# Altium schematic sheet HalfBridge_MOSFET.SchDoc
size A4
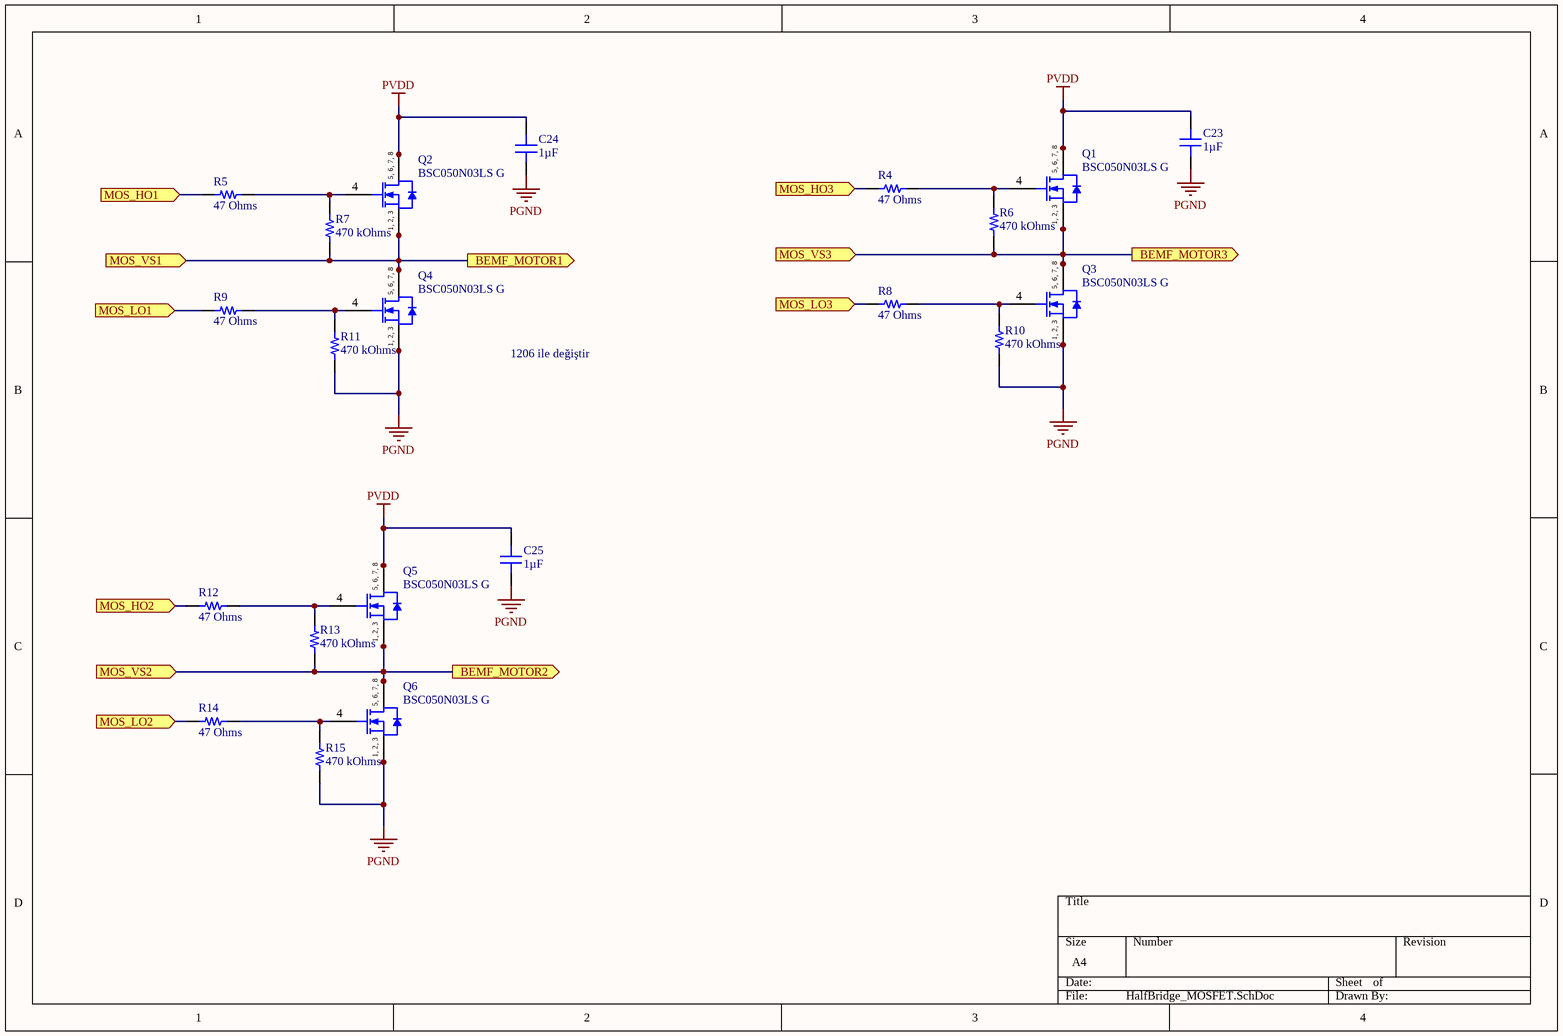
[diagram p0: HalfBridge_MOSFET.SchDoc]

## Parts
C23  1µF  [CAP 1206_3216 - 1.8MM]
C24  1µF  [CAP 1206_3216 - 1.8MM]
C25  1µF  [CAP 1206_3216 - 1.8MM]
Q1  BSC050N03LS G  [INF-PG-TDSON-8-1_V]
Q2  BSC050N03LS G  [INF-PG-TDSON-8-1_V]
Q3  BSC050N03LS G  [INF-PG-TDSON-8-1_V]
Q4  BSC050N03LS G  [INF-PG-TDSON-8-1_V]
Q5  BSC050N03LS G  [INF-PG-TDSON-8-1_V]
Q6  BSC050N03LS G  [INF-PG-TDSON-8-1_V]
R4  47 Ohms  [RES 1206_3216]
R5  47 Ohms  [RES 1206_3216]
R6  470 kOhms  [RES 1206_3216]
R7  470 kOhms  [RES 1206_3216]
R8  47 Ohms  [RES 1206_3216]
R9  47 Ohms  [RES 1206_3216]
R10  470 kOhms  [RES 1206_3216]
R11  470 kOhms  [RES 1206_3216]
R12  47 Ohms  [RES 1206_3216]
R13  470 kOhms  [RES 1206_3216]
R14  47 Ohms  [RES 1206_3216]
R15  470 kOhms  [RES 1206_3216]

## Ports
BEMF_MOTOR1 (out), BEMF_MOTOR2 (out), BEMF_MOTOR3 (out), MOS_HO1 (in), MOS_HO2 (in), MOS_HO3 (in), MOS_LO1 (in), MOS_LO2 (in), MOS_LO3 (in), MOS_VS1 (in), MOS_VS2 (in), MOS_VS3 (in)

## Nets
PGND: C23.1 C24.1 C25.1 Q3.1(SOURCE) Q3.2(SOURCE) Q3.3(SOURCE) Q4.1(SOURCE) Q4.2(SOURCE) Q4.3(SOURCE) Q6.1(SOURCE) Q6.2(SOURCE) Q6.3(SOURCE) R10.1 R11.1 R15.1
PVDD: C23.2 C24.2 C25.2 Q1.5(DRAIN) Q1.6(DRAIN) Q1.7(DRAIN) Q1.8(DRAIN) Q2.5(DRAIN) Q2.6(DRAIN) Q2.7(DRAIN) Q2.8(DRAIN) Q5.5(DRAIN) Q5.6(DRAIN) Q5.7(DRAIN) Q5.8(DRAIN)
BEMF_MOTOR1: Q2.1(SOURCE) Q2.2(SOURCE) Q2.3(SOURCE) Q4.5(DRAIN) Q4.6(DRAIN) Q4.7(DRAIN) Q4.8(DRAIN) R7.1 ; port MOS_VS1, port BEMF_MOTOR1
BEMF_MOTOR2: Q5.1(SOURCE) Q5.2(SOURCE) Q5.3(SOURCE) Q6.5(DRAIN) Q6.6(DRAIN) Q6.7(DRAIN) Q6.8(DRAIN) R13.1 ; port MOS_VS2, port BEMF_MOTOR2
BEMF_MOTOR3: Q1.1(SOURCE) Q1.2(SOURCE) Q1.3(SOURCE) Q3.5(DRAIN) Q3.6(DRAIN) Q3.7(DRAIN) Q3.8(DRAIN) R6.1 ; port MOS_VS3, port BEMF_MOTOR3
MOS_HO1: R5.1 ; port MOS_HO1
MOS_HO2: R12.1 ; port MOS_HO2
MOS_HO3: R4.1 ; port MOS_HO3
MOS_LO1: R9.1 ; port MOS_LO1
MOS_LO2: R14.1 ; port MOS_LO2
MOS_LO3: R8.1 ; port MOS_LO3
NetQ1_4: Q1.4(GATE) R4.2 R6.2
NetQ2_4: Q2.4(GATE) R5.2 R7.2
NetQ3_4: Q3.4(GATE) R8.2 R10.2
NetQ4_4: Q4.4(GATE) R9.2 R11.2
NetQ5_4: Q5.4(GATE) R12.2 R13.2
NetQ6_4: Q6.4(GATE) R14.2 R15.2

## Notes on the sheet
- 1206 ile değiştir
- (in symbol BSC050N03LS G_1) 5, 6, 7, 8; 1, 2, 3

## Library data of the parts
C23-C25 = HMK316B7105KLHT: CAP CER 1UF 100V X7R 1206; Manufacturer: Taiyo Yuden; Tolerance: ±10%; Part Number: HMK316B7105KLHT; Value: 1µF; Applications: Automotive; Capacitance: 1µF; ComponentLink1Description: Datasheet; ComponentLink1URL: https://www.yuden.co.jp/productdata/catalog/mlcc06_hq_e.pdf; ComponentLink2Description: DigiKey Link; ComponentLink2URL: http://digikey.com/product-detail/en/taiyo-yuden/HMK316B7105KLHT/587-6325-1-ND/9949911; Device Package: 1206 (3216 Metric); Features: High Voltage; LastUpdated: 2.9.2020 01:05:24; Lifecycle Status: Active; Minimum Order: 1; Mounting Type: Surface Mount, MLCC; Operating Temperature: -55°C ~ 125°C; Package / Case: 1206 (3216 Metric); Packaging: TapeAndReel; PartId: 22611; Part Status: Active; Price: 0.13; Ratings: AEC-Q200; Series: M; Size / Dimension: 0.126" L x 0.063" W (3.20mm x 1.60mm); Supplier 1: DigiKey; Supplier Part Number 1: 587-6325-1-ND; Temperature Coefficient: X7R; Thickness (Max): 0.071" (1.80mm); Voltage - Rated: 100V
Q1-Q6 = BSC050N03LS G_1: N-Channel OptiMOS 3 Power-MOSFET, 30 V VDS, 79 A ID, -55 to 150 degC, PG-TDSON-8-1, Reel, Green; Manufacturer: Infineon; Polarity: N; VGS(th) (min): 1Â V; RthJA (max): 50Â K/W; RDS (on) (max): 5Â mOhm; RDS (on) (max) (@4.5V): 7.5Â mOhm; RthJC (max): 2.6Â K/W; VGS(th) (max): 2.2Â V; VDS (max): 30Â V; Green: TRUE; ID (max): 79Â A; IDpuls (max): 316Â A; Ptot (max): 48Â W; QG: 13Â nC; PartNumber: BSC050N03LS G; ComponentLink1Description: Manufacturer URL; ComponentLink2Description: Datasheet; DatasheetVersion: Rev. 1.6; ComponentLink3URL: http://www.infineon.com/cms/packages/SMD_-_Surface_Mounted_Devices/P-PG-TDSON/P-PG-TDSON-08-01x_2x_3.html?__locale=en; ComponentLink1URL: http://www.infineon.com/; Packing: Reel; ComponentLink2URL: http://www.infineon.com/dgdl/BSC050N03LS_rev1.6.pdf?folderId=db3a304412b407950112b408e8c90004&fileId=db3a304412b407950112b4276b953c2b; ComponentLink3Description: Package Specification; Rth: 2.6Â K/W; Halogen-free: TRUE; Mounting Technology: Surface Mount; PackageReference: PG-TDSON-8-1; PackageDescription: 8-Pin Plastic (Green) Thin Dual Small Outline Non-Leaded Package, 5.15 x 5.9 mm Body, 1.27 mm Pitch
R4 R5 R8 R9 R12 R14 = CRCW120647R0JNEAIF: RES SMD 47 OHM 5% 1/4W 1206; Manufacturer: Vishay Dale; Power (Watts): 0.25W, 1/4W; Temperature Coefficient: ±200ppm/°C; Part Number: CRCW120647R0JNEAIF; ComponentLink1Description: Datasheet; ComponentLink1URL: http://www.vishay.com/docs/20024/dcrcwife3.pdf; ComponentLink2Description: DigiKey Link; ComponentLink2URL: http://digikey.com/product-detail/en/vishay-dale/CRCW120647R0JNEAIF/541-47ARCT-ND/3477236; Composition: Thick Film; Device Package: 1206 (3216 Metric); Features: Automotive AEC-Q200, Pulse Withstanding; Height - Seated (Max): 0.024" (0.60mm); LastUpdated: 2.9.2020 01:12:26; Lifecycle Status: Active; Minimum Order: 1; Number of Terminations: 2; Operating Temperature: -55°C ~ 155°C; Package / Case: 1206 (3216 Metric); Packaging: TapeAndReel; PartId: 45398; Part Status: Active; Price: 0.10; Ratings: AEC-Q200; Resistance: 47 Ohms; Series: CRCW-IF; Size / Dimension: 0.126" L x 0.063" W (3.20mm x 1.60mm); Supplier 1: DigiKey; Supplier Part Number 1: 541-47ARCT-ND; Supplier Device Package: 1206; Tolerance: ±5%; Value: 47 Ohms
R6 R7 R10 R11 R13 R15 = CRCW1206470KFKEA: RES SMD 470K OHM 1% 1/4W 1206; Manufacturer: Vishay Dale; Power (Watts): 0.25W, 1/4W; Temperature Coefficient: ±100ppm/°C; Part Number: CRCW1206470KFKEA; ComponentLink1Description: Datasheet; ComponentLink1URL: http://www.vishay.com/docs/20035/dcrcwe3.pdf; ComponentLink2Description: DigiKey Link; ComponentLink2URL: http://digikey.com/product-detail/en/vishay-dale/CRCW1206470KFKEA/541-470KFCT-ND/1182064; Composition: Thick Film; Device Package: 1206 (3216 Metric); Features: Automotive AEC-Q200; Height - Seated (Max): 0.024" (0.60mm); LastUpdated: 2.9.2020 01:12:24; Lifecycle Status: Active; Minimum Order: 1; Number of Terminations: 2; Operating Temperature: -55°C ~ 155°C; Package / Case: 1206 (3216 Metric); Packaging: TapeAndReel; PartId: 45814; Part Status: Active; Price: 0.01; Ratings: AEC-Q200; Resistance: 470 kOhms; Series: CRCW; Size / Dimension: 0.126" L x 0.063" W (3.20mm x 1.60mm); Supplier 1: DigiKey; Supplier Part Number 1: 541-470KFCT-ND; Supplier Device Package: 1206; Tolerance: ±1%; Value: 470 kOhms